# EAGLE design Dual6X03 (EAGLE 7.7.0)
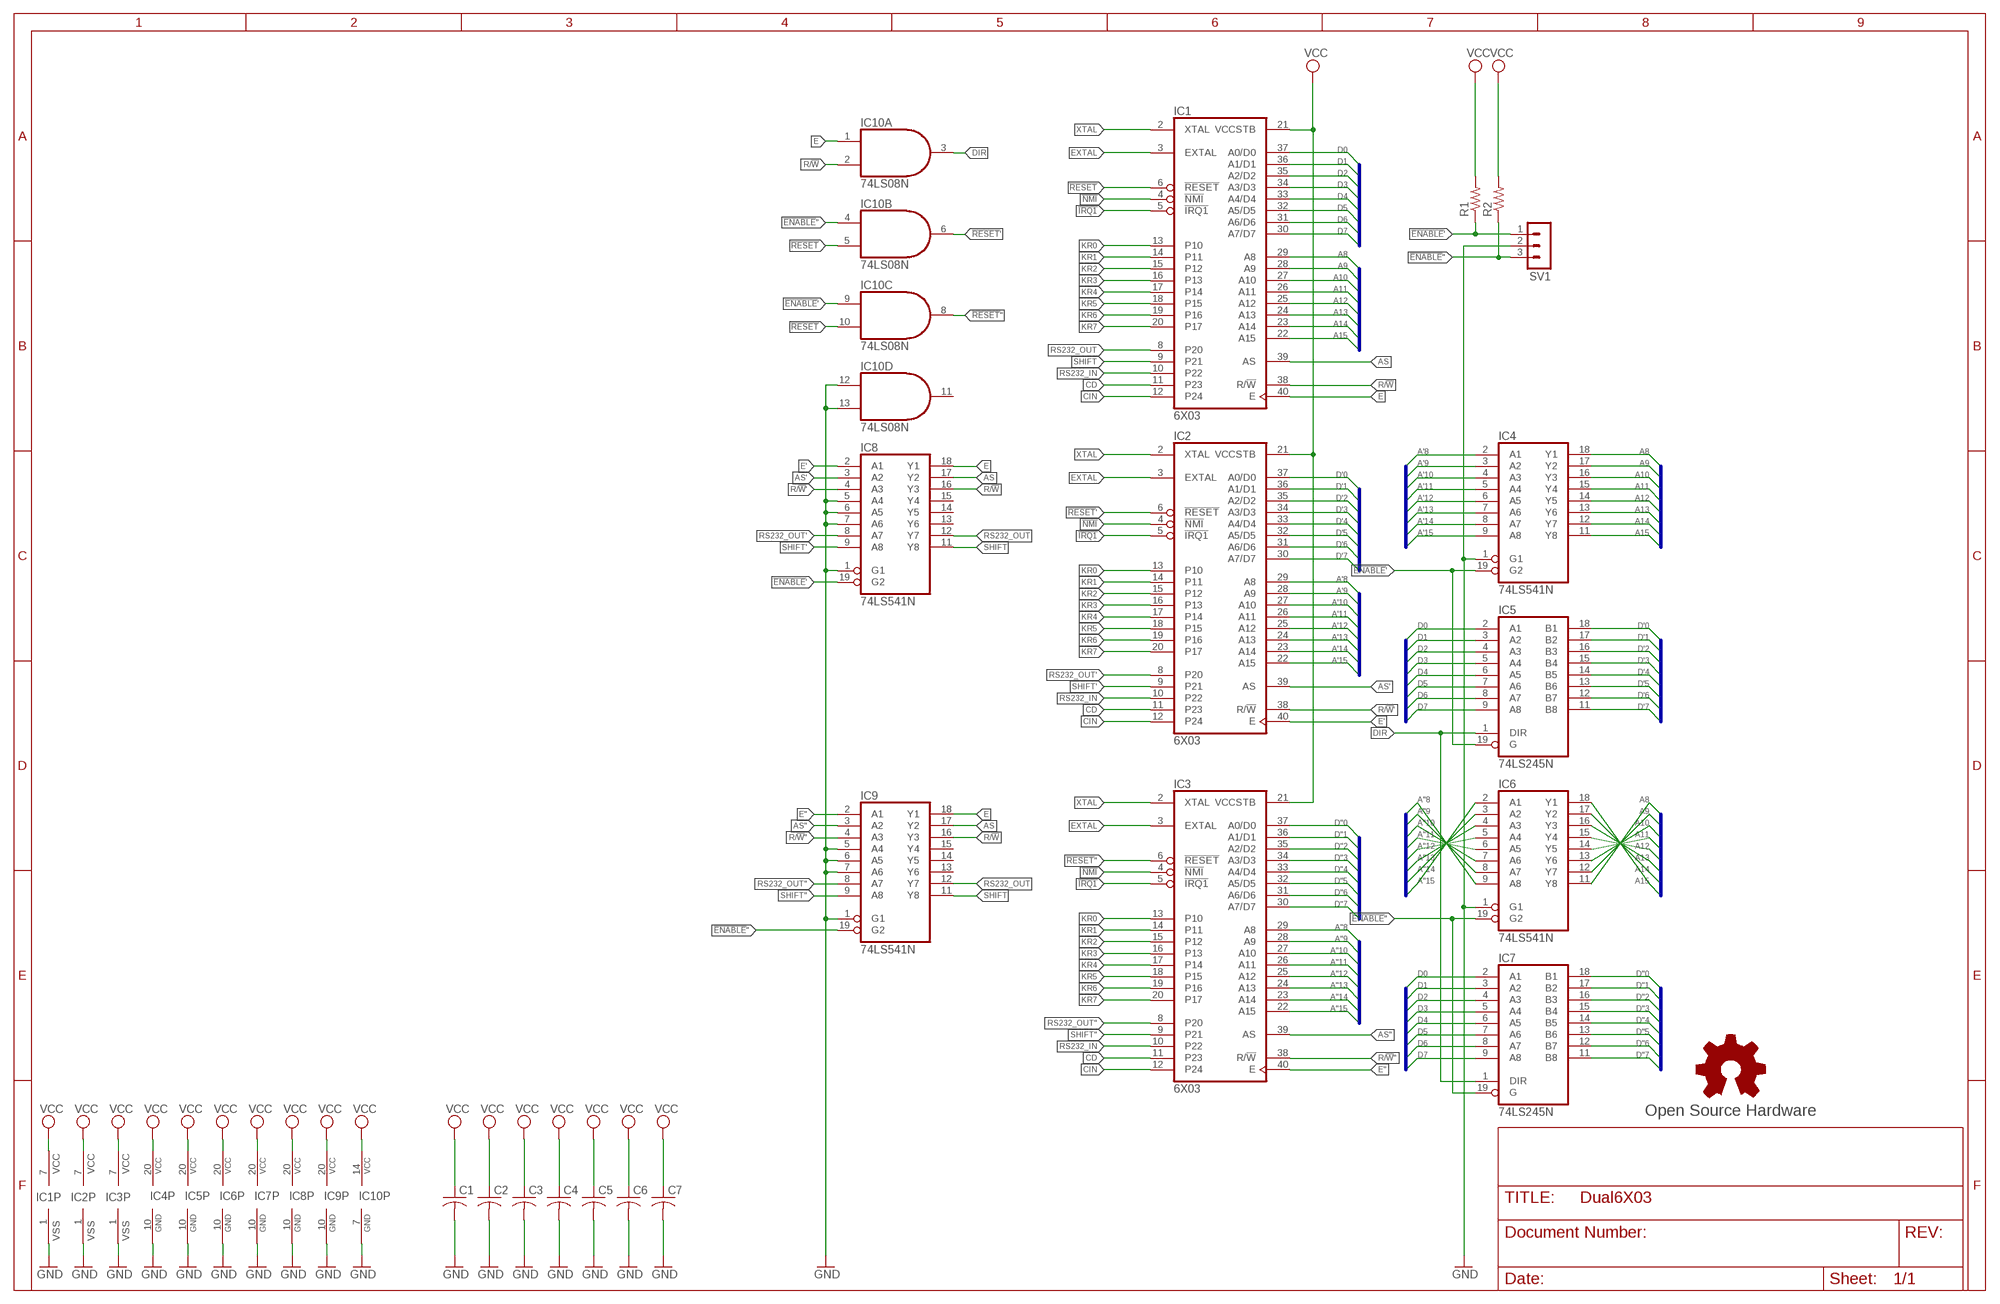
[diagram p0: schematic, sheet 1]

## Parts
C1  C-US025-025X050  [C025-025X050]
C2  C-US025-025X050  [C025-025X050]
C3  C-US025-025X050  [C025-025X050]
C4  C-US025-025X050  [C025-025X050]
C5  C-US025-025X050  [C025-025X050]
C6  C-US025-025X050  [C025-025X050]
C7  C-US025-025X050  [C025-025X050]
GOLD_ORB_SM1  Open Source Hardware  OSHWLOGOLOGO8MM  [OSHW_8MM]
IC1  6X03  6801EMR  [DIL40-ROUNDPAD]
IC2  6X03  6801EMR  [DIL40-ROUNDPAD]
IC3  6X03  6801EMR  [DIL40-ROUNDPAD]
IC4  74LS541N  [DIL20]
IC5  74LS245N  [DIL20]
IC6  74LS541N  [DIL20]
IC7  74LS245N  [DIL20]
IC8  74LS541N  [DIL20]
IC9  74LS541N  [DIL20]
IC10  74LS08N  [DIL14]
R1  R-US_0204/2V  [0204V]
R2  R-US_0204/2V  [0204V]
SV1  MA03-1  [MA03-1]

## Nets
!ENABLE!': IC4.19(G2) IC5.19(G) IC8.19(G2) IC10.9(C:I0) R1.1 SV1.1
!ENABLE!'': IC6.19(G2) IC7.19(G) IC9.19(G2) IC10.4(B:I0) R2.1 SV1.3
!IRQ1: IC1.5(!IRQ1) IC2.5(!IRQ1) IC3.5(!IRQ1)
!NMI: IC1.4(!NMI) IC2.4(!NMI) IC3.4(!NMI)
!RESET: IC1.6(!RESET) IC10.5(B:I1) IC10.10(C:I1)
!RESET!': IC2.6(!RESET) IC10.6(B:O)
!RESET!'': IC3.6(!RESET) IC10.8(C:O)
A8: IC1.29(A8) IC4.18(Y1) IC6.11(Y8)
A9: IC1.28(A9) IC4.17(Y2) IC6.12(Y7)
A10: IC1.27(A10) IC4.16(Y3) IC6.13(Y6)
A11: IC1.26(A11) IC4.15(Y4) IC6.14(Y5)
A12: IC1.25(A12) IC4.14(Y5) IC6.15(Y4)
A13: IC1.24(A13) IC4.13(Y6) IC6.16(Y3)
A14: IC1.23(A14) IC4.12(Y7) IC6.17(Y2)
A15: IC1.22(A15) IC4.11(Y8) IC6.18(Y1)
A'8: IC2.29(A8) IC4.2(A1)
A'9: IC2.28(A9) IC4.3(A2)
A'10: IC2.27(A10) IC4.4(A3)
A'11: IC2.26(A11) IC4.5(A4)
A'12: IC2.25(A12) IC4.6(A5)
A'13: IC2.24(A13) IC4.7(A6)
A'14: IC2.23(A14) IC4.8(A7)
A'15: IC2.22(A15) IC4.9(A8)
A''8: IC3.29(A8) IC6.9(A8)
A''9: IC3.28(A9) IC6.8(A7)
A''10: IC3.27(A10) IC6.7(A6)
A''11: IC3.26(A11) IC6.6(A5)
A''12: IC3.25(A12) IC6.5(A4)
A''13: IC3.24(A13) IC6.4(A3)
A''14: IC3.23(A14) IC6.3(A2)
A''15: IC3.22(A15) IC6.2(A1)
AS: IC1.39(AS) IC8.17(Y2) IC9.17(Y2)
AS': IC2.39(AS) IC8.3(A2)
AS'': IC3.39(AS) IC9.3(A2)
CD: IC1.11(P23) IC2.11(P23) IC3.11(P23)
CIN: IC1.12(P24) IC2.12(P24) IC3.12(P24)
D0: IC1.37(A0/D0) IC5.2(A1) IC7.2(A1)
D1: IC1.36(A1/D1) IC5.3(A2) IC7.3(A2)
D2: IC1.35(A2/D2) IC5.4(A3) IC7.4(A3)
D3: IC1.34(A3/D3) IC5.5(A4) IC7.5(A4)
D4: IC1.33(A4/D4) IC5.6(A5) IC7.6(A5)
D5: IC1.32(A5/D5) IC5.7(A6) IC7.7(A6)
D6: IC1.31(A6/D6) IC5.8(A7) IC7.8(A7)
D7: IC1.30(A7/D7) IC5.9(A8) IC7.9(A8)
D'0: IC2.37(A0/D0) IC5.18(B1)
D'1: IC2.36(A1/D1) IC5.17(B2)
D'2: IC2.35(A2/D2) IC5.16(B3)
D'3: IC2.34(A3/D3) IC5.15(B4)
D'4: IC2.33(A4/D4) IC5.14(B5)
D'5: IC2.32(A5/D5) IC5.13(B6)
D'6: IC2.31(A6/D6) IC5.12(B7)
D'7: IC2.30(A7/D7) IC5.11(B8)
D''0: IC3.37(A0/D0) IC7.18(B1)
D''1: IC3.36(A1/D1) IC7.17(B2)
D''2: IC3.35(A2/D2) IC7.16(B3)
D''3: IC3.34(A3/D3) IC7.15(B4)
D''4: IC3.33(A4/D4) IC7.14(B5)
D''5: IC3.32(A5/D5) IC7.13(B6)
D''6: IC3.31(A6/D6) IC7.12(B7)
D''7: IC3.30(A7/D7) IC7.11(B8)
DIR: IC5.1(DIR) IC7.1(DIR) IC10.3(A:O)
E: IC1.40(E) IC8.18(Y1) IC9.18(Y1) IC10.1(A:I0)
E': IC2.40(E) IC8.2(A1)
E'': IC3.40(E) IC9.2(A1)
EXTAL: IC1.3(EXTAL) IC2.3(EXTAL) IC3.3(EXTAL)
GND: C1.2 C2.2 C3.2 C4.2 C5.2 C6.2 C7.2 IC1.1(VSS) IC2.1(VSS) IC3.1(VSS) IC4.1(G1) IC4.10(GND) IC5.10(GND) IC6.1(G1) IC6.10(GND) IC7.10(GND) IC8.1(G1) IC8.5(A4) IC8.6(A5) IC8.7(A6) IC8.10(GND) IC9.1(G1) IC9.5(A4) IC9.6(A5) IC9.7(A6) IC9.10(GND) IC10.7(P:GND) IC10.12(D:I0) IC10.13(D:I1) SV1.2
KR0: IC1.13(P10) IC2.13(P10) IC3.13(P10)
KR1: IC1.14(P11) IC2.14(P11) IC3.14(P11)
KR2: IC1.15(P12) IC2.15(P12) IC3.15(P12)
KR3: IC1.16(P13) IC2.16(P13) IC3.16(P13)
KR4: IC1.17(P14) IC2.17(P14) IC3.17(P14)
KR5: IC1.18(P15) IC2.18(P15) IC3.18(P15)
KR6: IC1.19(P16) IC2.19(P16) IC3.19(P16)
KR7: IC1.20(P17) IC2.20(P17) IC3.20(P17)
R/!W: IC1.38(R/!W) IC8.16(Y3) IC9.16(Y3) IC10.2(A:I1)
R/!W!': IC2.38(R/!W) IC8.4(A3)
R/!W!'': IC3.38(R/!W) IC9.4(A3)
RS232_IN: IC1.10(P22) IC2.10(P22) IC3.10(P22)
RS232_OUT: IC1.8(P20) IC8.12(Y7) IC9.12(Y7)
RS232_OUT': IC2.8(P20) IC8.8(A7)
RS232_OUT'': IC3.8(P20) IC9.8(A7)
SHIFT: IC1.9(P21) IC8.11(Y8) IC9.11(Y8)
SHIFT': IC2.9(P21) IC8.9(A8)
SHIFT'': IC3.9(P21) IC9.9(A8)
VCC: C1.1 C2.1 C3.1 C4.1 C5.1 C6.1 C7.1 IC1.7(VCC) IC1.21(VCCSTB) IC2.7(VCC) IC2.21(VCCSTB) IC3.7(VCC) IC3.21(VCCSTB) IC4.20(VCC) IC5.20(VCC) IC6.20(VCC) IC7.20(VCC) IC8.20(VCC) IC9.20(VCC) IC10.14(P:VCC) R1.2 R2.2
XTAL: IC1.2(XTAL) IC2.2(XTAL) IC3.2(XTAL)
Unconnected: IC8.13(Y6) IC8.14(Y5) IC8.15(Y4) IC9.13(Y6) IC9.14(Y5) IC9.15(Y4) IC10.11(D:O)

## Buses
A[8..15]
D'[0..7]
D[0..7]
A'[8..15]
A''[8..15]
D''[0..7]

## Library data of the parts
C1-C7 = rcl:C-US: CAPACITOR, American symbol
GOLD_ORB_SM1 = oshw:OSHWLOGO: The OSHW logo for PCB layout
IC1-IC3 = micro-motorola:6801EM: MICROCONTROLLER/MEMORY DEVICE
IC4 IC6 IC8 IC9 = 74xx-us:74*541: Octal BUFFER and LINE DRIVER, 3-state
IC5 IC7 = 74xx-us:74*245: Octal BUS TRANSCEIVER, 3-state
IC10 = 74xx-us:74*08: Quad 2-input AND gate
R1 R2 = resistor:R-US_: RESISTOR, American symbol
SV1 = con-lstb-rp:MA03-1: PIN HEADER; OC_FARNELL: unknown; OC_NEWARK: unknown

## Board
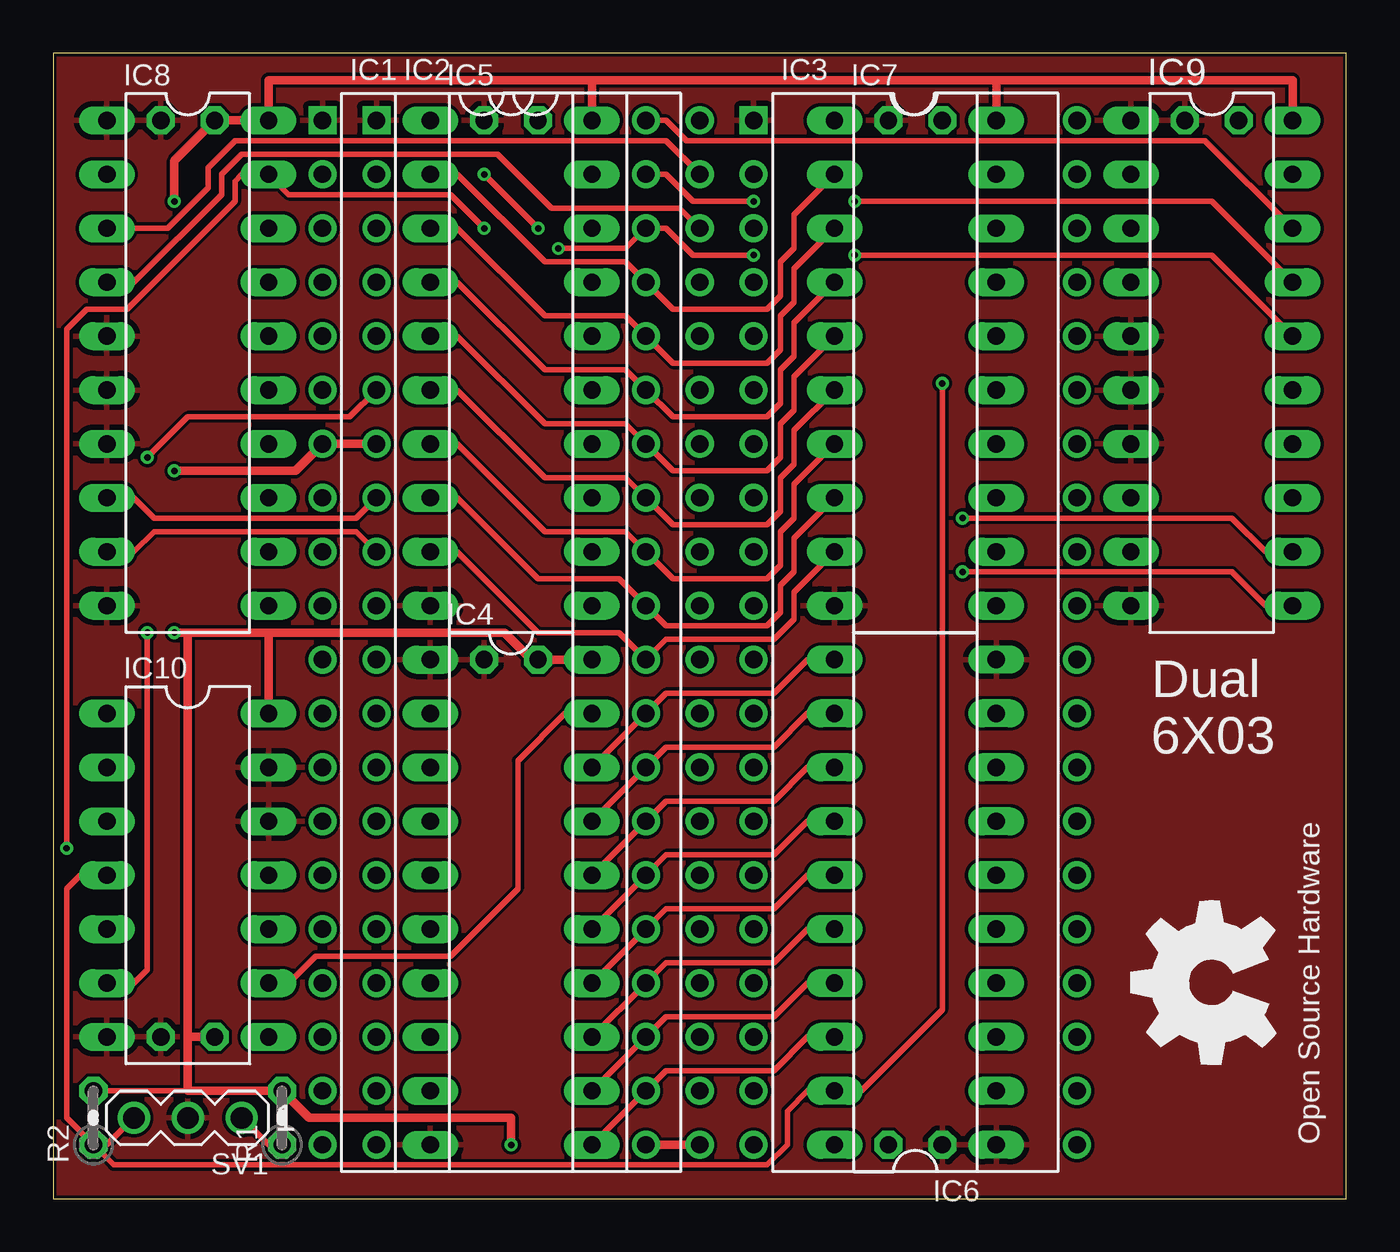
[diagram p1: board, top side]
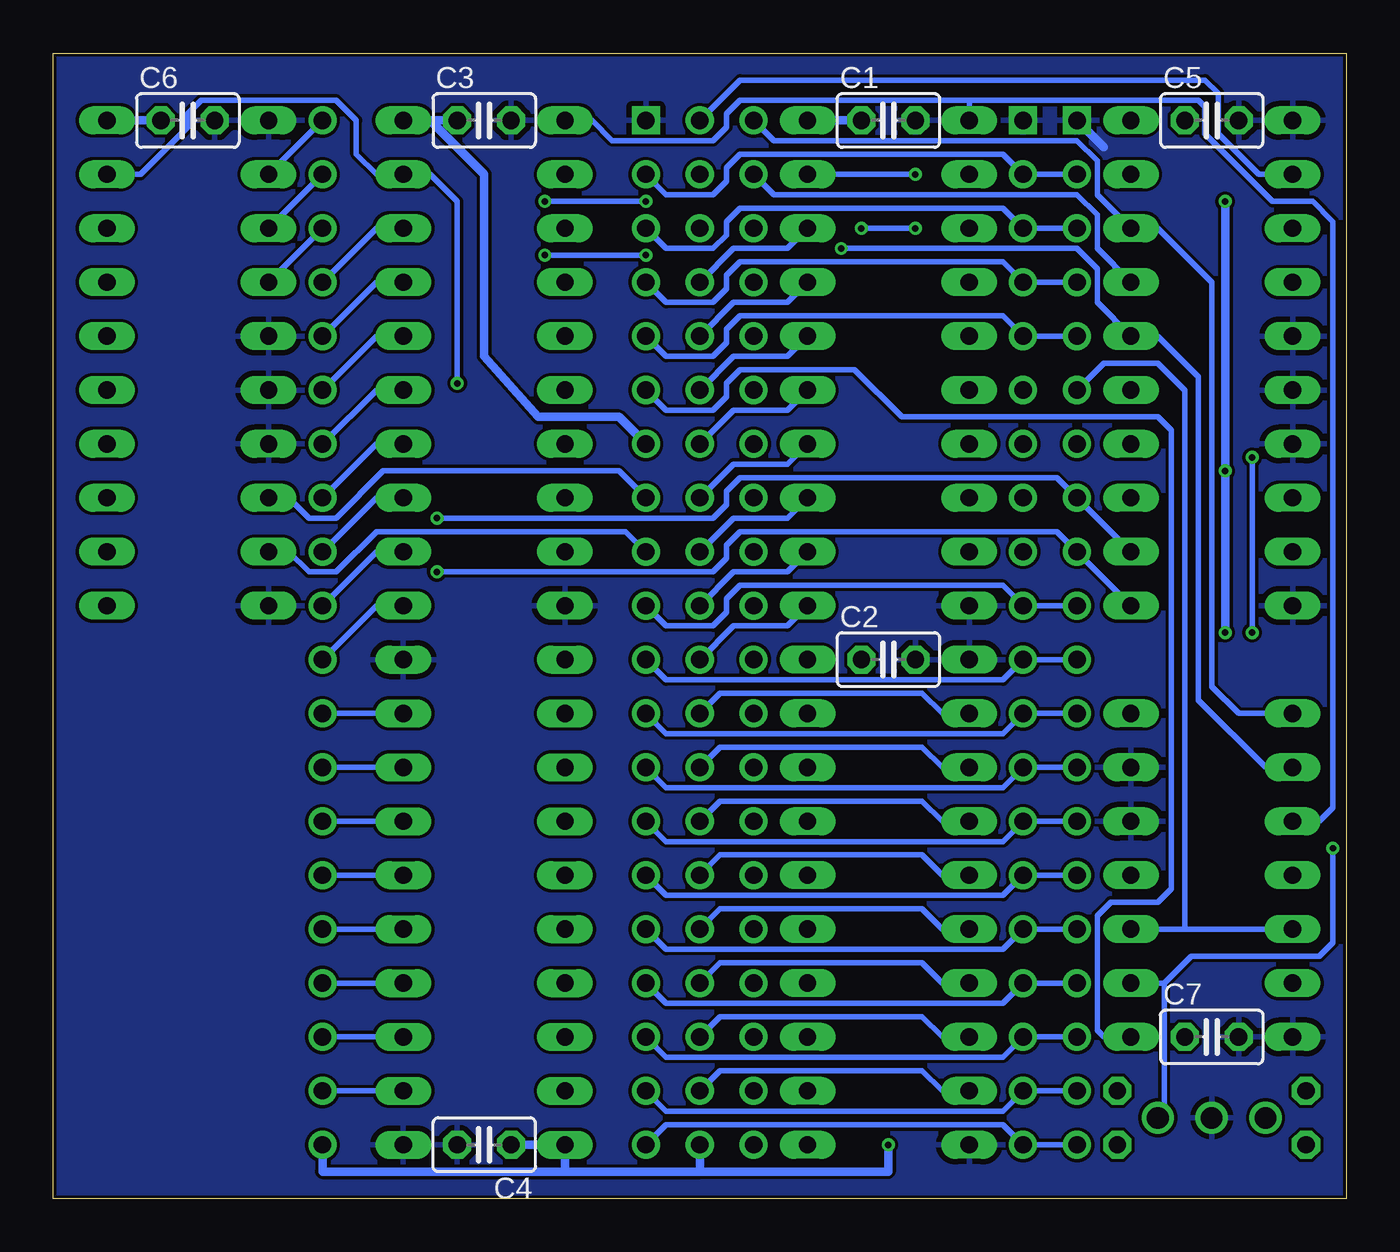
[diagram p2: board, bottom side, seen from below]

Size 60.96 x 53.98 mm. Coordinates in mm from the lower left corner, seen from the top.
Outline: 0,0 60.94,0 60.96,53.98 0,53.98 0,0
Copper layers (1*16): Top 0.035mm / dielectric 1.5mm / Bottom 0.035mm
Design rules "hackvana": minimum track width 6mil, minimum drill 0.3mm, track to track 6mil, track to pad 6mil, pad to pad 6mil, via to via 6mil, smd to smd 0mil, copper to edge 6mil, drill to drill 6mil, minimum pad ring 10mil, minimum via ring 6mil, stop-mask expansion 2mil, vias tented up to drill 100mil, thermal gap 10mil

### Footprints (pad centres in the part's own frame; a part is rotated, then mirrored left to right if it is on the bottom)
C025-025X050 = drill 0.813 octagon: 1 -1.27,0; 2 1.27,0
DIL40-ROUNDPAD = drill 0.813 square: 1 -24.13,-7.62 | drill 0.813: 2 -21.59,-7.62; 3 -19.05,-7.62; 4 -16.51,-7.62; 5 -13.97,-7.62; 6 -11.43,-7.62; 7 -8.89,-7.62; 8 -6.35,-7.62; 9 -3.81,-7.62; 10 -1.27,-7.62; 11 1.27,-7.62; 12 3.81,-7.62; 13 6.35,-7.62; 14 8.89,-7.62; 15 11.43,-7.62; 16 13.97,-7.62; 17 16.51,-7.62; 18 19.05,-7.62; 19 21.59,-7.62; 20 24.13,-7.62; 21 24.13,7.62; 22 21.59,7.62; 23 19.05,7.62; 24 16.51,7.62; 25 13.97,7.62; 26 11.43,7.62; 27 8.89,7.62; 28 6.35,7.62; 29 3.81,7.62; 30 1.27,7.62; 31 -1.27,7.62; 32 -3.81,7.62; 33 -6.35,7.62; 34 -8.89,7.62; 35 -11.43,7.62; 36 -13.97,7.62; 37 -16.51,7.62; 38 -19.05,7.62; 39 -21.59,7.62; 40 -24.13,7.62
DIL20 = drill 0.813 long: 1 -11.43,-3.81; 2 -8.89,-3.81; 3 -6.35,-3.81; 4 -3.81,-3.81; 5 -1.27,-3.81; 6 1.27,-3.81; 7 3.81,-3.81; 8 6.35,-3.81; 9 8.89,-3.81; 10 11.43,-3.81; 11 11.43,3.81; 12 8.89,3.81; 13 6.35,3.81; 14 3.81,3.81; 15 1.27,3.81; 16 -1.27,3.81; 17 -3.81,3.81; 18 -6.35,3.81; 19 -8.89,3.81; 20 -11.43,3.81
DIL14 = drill 0.813 long: 1 -7.62,-3.81; 2 -5.08,-3.81; 3 -2.54,-3.81; 4 0,-3.81; 5 2.54,-3.81; 6 5.08,-3.81; 7 7.62,-3.81; 8 7.62,3.81; 9 5.08,3.81; 10 2.54,3.81; 11 0,3.81; 12 -2.54,3.81; 13 -5.08,3.81; 14 -7.62,3.81
0204V = drill 0.813 octagon: 1 -1.27,0; 2 1.27,0
MA03-1 = drill 1.016: 1 -2.54,0; 2 0,0; 3 2.54,0

### Placement (x,y rotation side)
C1  21.59,50.8 0 bottom
C2  21.59,25.4 0 bottom
C3  40.64,50.8 0 bottom
C4  40.64,2.54 180 bottom
C5  6.35,50.8 0 bottom
C6  54.61,50.8 0 bottom
C7  6.35,7.62 0 bottom
GOLD_ORB_SM1  54.61,10.16 90 top
IC1  20.32,26.67 270 top
IC2  22.86,26.67 270 top
IC3  40.64,26.67 270 top
IC4  21.59,13.97 270 top
IC5  21.59,39.37 270 top
IC6  40.64,13.97 90 top
IC7  40.64,39.37 270 top
IC8  6.35,39.37 270 top
IC9  54.61,39.37 270 top
IC10  6.35,15.24 270 top
R1  10.79,3.81 90 top
R2  1.9,3.81 90 top
SV1  6.35,3.81 180 top

### Tracks (layer width: path | path; a pad name or v marks a point on that pad's centre or on a via)
!ENABLE!'  (via drill 0.3)
  Top 0.254: IC4.19 24.13,22.86 21.91,20.64 21.91,14.61 18.73,11.43 12.38,11.43 11.11,10.16 IC10.9 | v20.32,45.72 18.73,47.31 11.11,47.31 IC8.19 8.89,48.26 8.57,47.94 8.57,46.99 3.49,41.91 1.59,41.91 0.63,40.96 v0.63,16.51 | v22.86,45.72 v20.32,48.26 | SV1.1 10.16,2.54 R1.1
  Bottom 0.254: v20.32,45.72 v22.86,45.72 | v20.32,48.26 IC5.19 | v0.63,16.51 0.63,12.06 1.27,11.43 7.3,11.43 8.57,10.16 | 8.57,10.16 IC10.9 | SV1.1 8.57,4.13 8.57,10.16
!ENABLE!''  (via drill 0.3)
  Top 0.254: v41.91,38.42 41.91,8.89 38.1,5.08 IC6.19 35.56,5.08 34.61,4.13 34.61,2.54 33.66,1.59 2.86,1.59 R2.1 | IC10.4 1.27,15.24 0.63,14.61 0.63,3.81 R2.1 | SV1.3 2.54,2.54 R2.1
  Bottom 0.254: v41.91,38.42 41.91,46.99 43.18,48.26 IC7.19 45.72,48.26 46.67,49.21 46.67,50.8 47.62,51.75 53.97,51.75 54.61,51.12 54.61,50.48 56.83,48.26 IC9.19
!IRQ1
  Bottom 0.254: IC1.5 IC2.5 16.19,41.59 28.57,41.59 29.21,40.96 29.21,40.32 29.84,39.69 32.07,39.69 IC3.5
!NMI
  Bottom 0.254: IC1.4 IC2.4 16.19,44.13 28.57,44.13 29.21,43.5 29.21,42.86 29.84,42.23 32.07,42.23 IC3.4
!RESET
  Bottom 0.254: IC10.5 7.62,12.7 | 7.62,12.7 IC10.10 | IC1.6 11.43,39.37 8.89,39.37 7.62,38.1 7.62,12.7
!RESET!'  (via drill 0.3)
  Top 0.254: IC2.6 13.97,36.83 6.35,36.83 v4.45,34.92 | v4.45,26.67 4.45,10.79 3.81,10.16 IC10.6
  Bottom 0.254: v4.45,34.92 v4.45,26.67
!RESET!''
  Bottom 0.254: IC3.6 32.07,37.15 29.84,37.15 29.21,37.78 29.21,38.42 28.57,39.05 23.18,39.05 20.95,36.83 8.89,36.83 8.26,36.2 8.26,14.61 8.89,13.97 11.11,13.97 11.75,13.34 11.75,7.94 11.43,7.62 IC10.8
A8
  Top 0.254: IC4.18 IC1.29 28.89,23.81 33.97,23.81 35.56,25.4 IC6.11
A9
  Top 0.254: IC4.17 IC1.28 28.89,21.27 33.97,21.27 35.56,22.86 IC6.12
A10
  Top 0.254: IC4.16 IC1.27 28.89,18.73 33.97,18.73 35.56,20.32 IC6.13
A11
  Top 0.254: IC4.15 IC1.26 28.89,16.19 33.97,16.19 35.56,17.78 IC6.14
A12
  Top 0.254: IC4.14 IC1.25 28.89,13.65 33.97,13.65 35.56,15.24 IC6.15
A13
  Top 0.254: IC4.13 IC1.24 28.89,11.11 33.97,11.11 35.56,12.7 IC6.16
A14
  Top 0.254: IC4.12 IC1.23 28.89,8.57 33.97,8.57 35.56,10.16 IC6.17
A15
  Top 0.254: IC4.11 IC1.22 28.89,6.03 33.97,6.03 35.56,7.62 IC6.18
A'8
  Bottom 0.254: IC4.2 19.05,22.86 20,23.81 29.53,23.81 IC2.29
A'9
  Bottom 0.254: IC4.3 19.05,20.32 20,21.27 29.53,21.27 IC2.28
A'10
  Bottom 0.254: IC4.4 19.05,17.78 20,18.73 29.53,18.73 IC2.27
A'11
  Bottom 0.254: IC4.5 19.05,15.24 20,16.19 29.53,16.19 IC2.26
A'12
  Bottom 0.254: IC4.6 19.05,12.7 20,13.65 29.53,13.65 IC2.25
A'13
  Bottom 0.254: IC4.7 19.05,10.16 20,11.11 29.53,11.11 IC2.24
A'14
  Bottom 0.254: IC4.8 19.05,7.62 20,8.57 29.53,8.57 IC2.23
A'15
  Bottom 0.254: IC4.9 19.05,5.08 20,6.03 29.53,6.03 IC2.22
A''8
  Bottom 0.254: IC3.29 IC6.9
A''9
  Bottom 0.254: IC6.8 IC3.28
A''10
  Bottom 0.254: IC3.27 IC6.7
A''11
  Bottom 0.254: IC6.6 IC3.26
A''12
  Bottom 0.254: IC3.25 IC6.5
A''13
  Bottom 0.254: IC3.24 IC6.4
A''14
  Bottom 0.254: IC6.3 IC3.23
A''15
  Bottom 0.254: IC3.22 IC6.2
AS  (via drill 0.3)
  Top 0.254: IC9.17 54.61,46.99 v37.78,46.99 | v33.02,46.99 30.16,46.99 28.89,48.26 IC1.39
  Bottom 0.254: IC1.39 26.99,47.31 12.7,47.31 11.75,46.35 11.75,44.77 IC8.17 | v37.78,46.99 v33.02,46.99
AS'
  Top 0.254: IC2.39 28.89,49.85 8.57,49.85 7.3,48.58 7.3,47.62 5.4,45.72 IC8.3
AS''
  Bottom 0.254: IC3.39 IC9.3
CD
  Bottom 0.254: IC1.11 IC2.11 16.19,24.45 32.07,24.45 IC3.11
CIN
  Bottom 0.254: IC1.12 IC2.12 16.19,21.91 32.07,21.91 IC3.12
D0
  Top 0.254: IC5.2 19.05,48.26 23.18,44.13 26.99,44.13 IC1.37 29.21,41.91 33.66,41.91 34.29,42.55 34.29,44.13 34.92,44.77 34.92,46.35 IC7.2
D1
  Top 0.254: IC5.3 19.05,45.72 23.18,41.59 26.99,41.59 IC1.36 29.21,39.37 33.66,39.37 34.29,40.01 34.29,41.59 34.92,42.23 34.92,43.81 IC7.3
D2
  Top 0.254: IC5.4 19.05,43.18 23.18,39.05 26.99,39.05 IC1.35 29.21,36.83 33.66,36.83 34.29,37.47 34.29,39.05 34.92,39.69 34.92,41.27 IC7.4
D3
  Top 0.254: IC5.5 19.05,40.64 23.18,36.51 26.99,36.51 IC1.34 29.21,34.29 33.66,34.29 34.29,34.92 34.29,36.51 34.92,37.15 34.92,38.73 IC7.5
D4
  Top 0.254: IC5.6 19.05,38.1 23.18,33.97 26.99,33.97 IC1.33 29.21,31.75 33.66,31.75 34.29,32.38 34.29,33.97 34.92,34.61 34.92,36.2 IC7.6
D5
  Top 0.254: IC5.7 19.05,35.56 23.18,31.43 26.99,31.43 IC1.32 29.21,29.21 33.66,29.21 34.29,29.84 34.29,31.43 34.92,32.07 34.92,33.66 IC7.7
D6
  Top 0.254: IC5.8 19.05,33.02 22.86,29.21 26.67,29.21 IC1.31 28.89,26.99 33.66,26.99 34.29,27.62 34.29,28.89 34.92,29.53 34.92,31.11 IC7.8
D7
  Top 0.254: IC5.9 19.05,30.48 22.86,26.67 26.67,26.67 IC1.30 28.89,26.35 33.97,26.35 34.92,27.3 34.92,28.57 IC7.9
D'0
  Bottom 0.254: IC5.18 26.35,44.77 28.89,44.77 IC2.37
D'1
  Bottom 0.254: IC5.17 26.35,42.23 28.89,42.23 IC2.36
D'2
  Bottom 0.254: IC5.16 26.35,39.69 28.89,39.69 IC2.35
D'3
  Bottom 0.254: IC5.15 26.35,37.15 28.89,37.15 IC2.34
D'4
  Bottom 0.254: IC5.14 26.35,34.61 28.89,34.61 IC2.33
D'5
  Bottom 0.254: IC5.13 26.35,32.07 28.89,32.07 IC2.32
D'6
  Bottom 0.254: IC5.12 26.35,29.53 28.89,29.53 IC2.31
D'7
  Bottom 0.254: IC5.11 26.35,26.99 28.89,26.99 IC2.30
D''0
  Bottom 0.254: IC3.37 45.72,45.72 IC7.18
D''1
  Bottom 0.254: IC3.36 45.72,43.18 IC7.17
D''2
  Bottom 0.254: IC3.35 45.72,40.64 IC7.16
D''3
  Bottom 0.254: IC3.34 45.72,38.1 IC7.15
D''4
  Bottom 0.254: IC3.33 45.72,35.56 IC7.14
D''5
  Bottom 0.254: IC3.32 45.72,33.02 IC7.13
D''6
  Bottom 0.254: IC3.31 45.72,30.48 IC7.12
D''7
  Bottom 0.254: IC3.30 45.72,27.94 IC7.11
DIR
  Bottom 0.254: 17.78,51.75 28.57,51.75 29.21,51.12 29.21,50.48 29.84,49.85 34.61,49.85 35.56,50.8 IC7.1 | IC5.1 17.78,51.75 | 17.78,51.75 6.99,51.75 6.67,51.44 6.67,50.16 3.49,46.99 1.59,46.99 0.63,46.04 0.63,18.41 1.27,17.78 IC10.3
E
  Top 0.254: IC9.18 54.29,49.85 29.84,49.85 28.89,50.8 IC1.40
  Bottom 0.254: IC1.40 26.99,49.85 12.7,49.85 11.75,48.9 11.75,47.31 IC8.18 8.89,45.72 6.35,43.18 6.35,24.13 5.08,22.86 IC10.1
E'
  Bottom 0.254: IC2.40 28.57,52.7 6.67,52.7 6.03,52.07 6.03,50.16 4.13,48.26 IC8.2
E''
  Bottom 0.254: IC3.40 IC9.2
EXTAL
  Bottom 0.254: IC1.3 IC2.3 16.19,46.67 28.57,46.67 29.21,46.04 29.21,45.4 29.84,44.77 32.07,44.77 IC3.3
GND
  Bottom 0.406: IC1.1 11.43,49.53
  pour Bottom: 0,53.98 60.96,53.98 60.96,0 0,0
  pour Top: 0,53.98 60.96,53.98 60.96,0 0,0
KR0
  Bottom 0.254: IC1.13 IC2.13 16.19,19.37 32.07,19.37 IC3.13
KR1
  Bottom 0.254: IC1.14 IC2.14 16.19,16.83 32.07,16.83 IC3.14
KR2
  Bottom 0.254: IC1.15 IC2.15 16.19,14.29 32.07,14.29 IC3.15
KR3
  Bottom 0.254: IC1.16 IC2.16 16.19,11.75 32.07,11.75 IC3.16
KR4
  Bottom 0.254: IC1.17 IC2.17 16.19,9.21 32.07,9.21 IC3.17
KR5
  Bottom 0.254: IC1.18 IC2.18 16.19,6.67 32.07,6.67 IC3.18
KR6
  Bottom 0.254: IC1.19 IC2.19 16.19,4.13 32.07,4.13 IC3.19
KR7
  Bottom 0.254: IC1.20 IC2.20 16.19,3.49 32.07,3.49 IC3.20
R/!W  (via drill 0.3)
  Top 0.254: v23.81,44.77 26.99,44.77 IC1.38 28.89,45.72 30.16,44.45 v33.02,44.45 | IC9.16 54.61,44.45 v37.78,44.45
  Bottom 0.254: v23.81,44.77 12.7,44.77 11.75,43.81 11.75,42.23 IC8.16 8.89,40.64 6.99,38.73 6.99,23.5 3.81,20.32 IC10.2 | v37.78,44.45 v33.02,44.45
R/!W!'
  Top 0.254: IC2.38 29.53,46.67 23.5,46.67 20.95,49.21 8.89,49.21 7.94,48.26 7.94,47.31 3.81,43.18 IC8.4
R/!W!''
  Bottom 0.254: IC3.38 IC9.4
RS232_IN
  Bottom 0.254: IC1.10 IC2.10 16.19,28.89 28.57,28.89 29.21,28.26 29.21,27.62 29.84,26.99 32.07,26.99 IC3.10
RS232_OUT  (via drill 0.3)
  Top 0.254: IC9.12 57.15,30.48 55.56,32.07 v42.86,32.07
  Bottom 0.254: IC8.12 IC1.8 13.65,33.97 28.57,33.97 29.21,33.34 29.21,32.7 29.84,32.07 v42.86,32.07
RS232_OUT'
  Top 0.254: IC2.8 14.29,32.07 4.76,32.07 3.81,33.02 IC8.8
RS232_OUT''
  Bottom 0.254: IC3.8 34.29,34.29 45.4,34.29 47.62,32.07 48.89,32.07 49.85,33.02 IC9.8
SHIFT  (via drill 0.3)
  Top 0.254: v42.86,29.53 55.56,29.53 57.15,27.94 IC9.11
  Bottom 0.254: IC8.11 IC1.9 13.65,31.43 28.57,31.43 29.21,30.8 29.21,30.16 29.84,29.53 v42.86,29.53
SHIFT'
  Top 0.254: IC2.9 14.29,31.43 4.76,31.43 3.81,30.48 IC8.9
SHIFT''
  Bottom 0.254: IC9.9 49.85,30.48 48.89,29.53 47.62,29.53 45.72,31.43 33.97,31.43 IC3.9
VCC  (via drill 0.3)
  Top 0.254: R2.2 6.35,5.08
  Top 0.406: IC4.20 C2.1 22.54,25.4 21.27,26.67 10.16,26.67 | 10.16,26.67 6.35,26.67 | 6.35,26.67 v5.71,26.67 | IC2.7 IC1.7 11.43,34.29 v5.71,34.29 | IC5.20 25.4,52.7 | 25.4,52.7 10.16,52.7 IC8.20 C5.1 5.71,48.9 v5.71,46.99 | IC9.20 58.42,52.7 44.45,52.7 | 44.45,52.7 25.4,52.7 | IC7.20 44.45,52.7 | IC1.21 IC2.21 | v21.59,2.54 21.59,3.81 12.06,3.81 R1.2 6.35,5.08 6.35,7.62 | IC10.14 10.16,26.67 | 6.35,7.62 6.35,26.67 | C7.1 6.35,7.62
  Bottom 0.406: v5.71,46.99 v5.71,34.29 v5.71,26.67 | IC3.7 34.29,36.83 38.1,36.83 40.64,39.69 40.64,48.26 43.18,50.8 IC7.20 C3.1 | 36.83,1.27 IC6.20 C4.1 | 36.83,1.27 30.48,1.27 | 30.48,1.27 IC2.21 | v21.59,2.54 21.59,1.27 30.48,1.27 | IC3.21 48.26,1.27 36.83,1.27 | C6.1 IC9.20 | C1.1 IC5.20
XTAL
  Bottom 0.254: IC1.2 IC2.2 16.19,49.21 28.57,49.21 29.21,48.58 29.21,47.94 29.84,47.31 32.07,47.31 IC3.2

### Text on the board
tNames: Dual / 6X03